# EAGLE schematic GSRv2 (EAGLE 7.4.0)
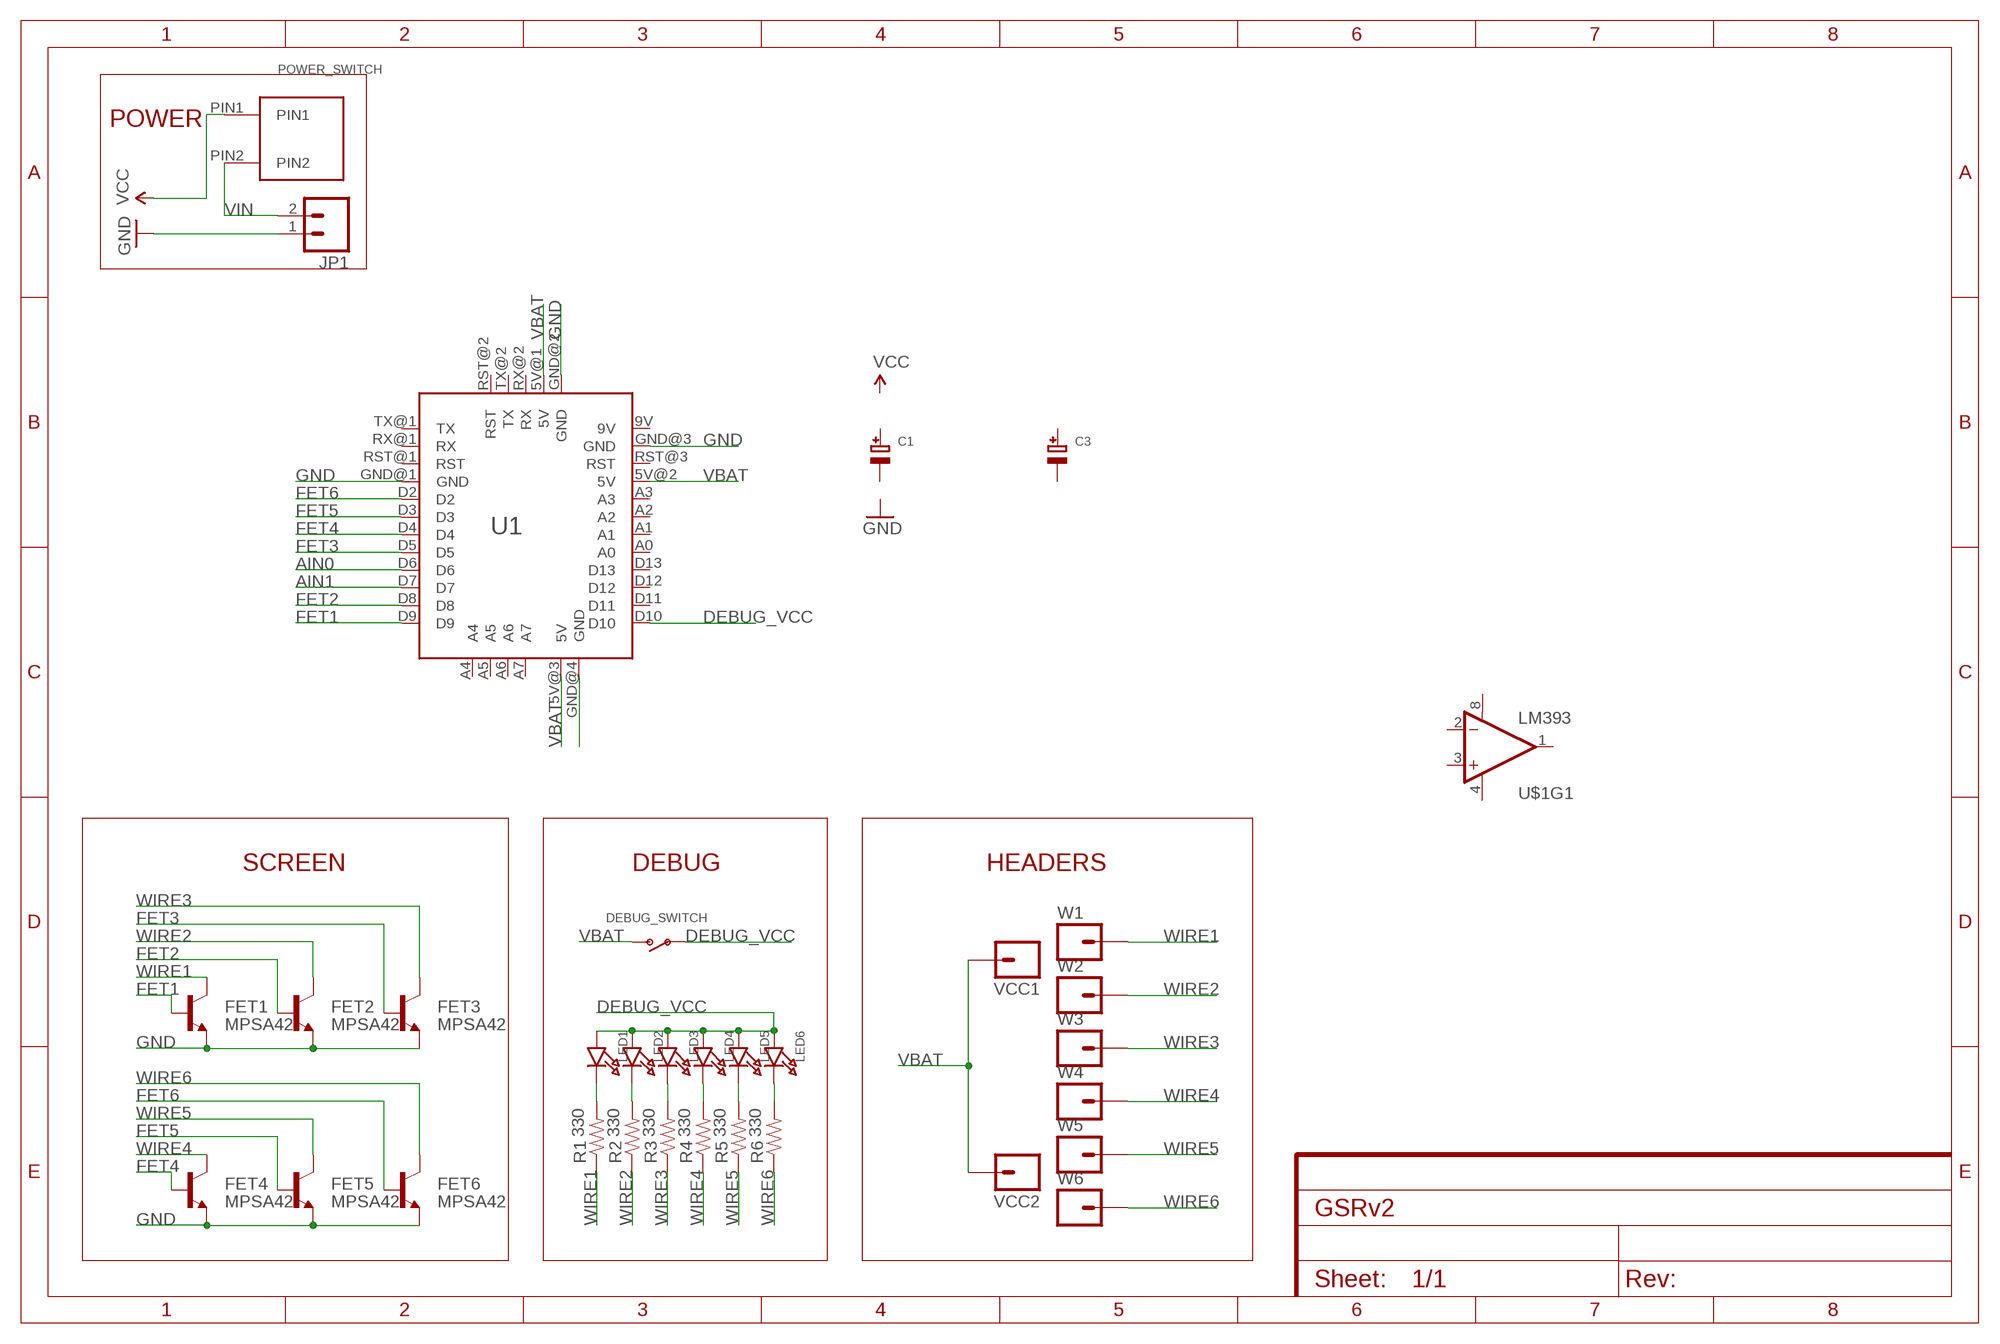
[diagram p0: schematic, sheet 1]

## Parts
C1  CAP_TANTALUMB/3528_WAVE  [EIA3528-21/B-W]
C3  CAP_TANTALUMB/3528_WAVE  [EIA3528-21/B-W]
DEBUG_SWITCH  SWITCH_SPST  [SPST_SMT_19192]
FET1  MPSA42  TRANSISTOR_NPNMPSA42  [SOT23-3]
FET2  MPSA42  TRANSISTOR_NPNMPSA42  [SOT23-3]
FET3  MPSA42  TRANSISTOR_NPNMPSA42  [SOT23-3]
FET4  MPSA42  TRANSISTOR_NPNMPSA42  [SOT23-3]
FET5  MPSA42  TRANSISTOR_NPNMPSA42  [SOT23-3]
FET6  MPSA42  TRANSISTOR_NPNMPSA42  [SOT23-3]
JP1  M02-JST-2MM-SMT  [JST-2-SMD]
LED1  LED0603_NOOUTLINE  [CHIPLED_0603_NOOUTLINE]
LED2  LED0603_NOOUTLINE  [CHIPLED_0603_NOOUTLINE]
LED3  LED0603_NOOUTLINE  [CHIPLED_0603_NOOUTLINE]
LED4  LED0603_NOOUTLINE  [CHIPLED_0603_NOOUTLINE]
LED5  LED0603_NOOUTLINE  [CHIPLED_0603_NOOUTLINE]
LED6  LED0603_NOOUTLINE  [CHIPLED_0603_NOOUTLINE]
POWER_SWITCH  PUSH_BUTTON  [PUSH_BUTTON]
R1  330  RESISTOR0603-RES  [0603-RES]
R2  330  RESISTOR0603-RES  [0603-RES]
R3  330  RESISTOR0603-RES  [0603-RES]
R4  330  RESISTOR0603-RES  [0603-RES]
R5  330  RESISTOR0603-RES  [0603-RES]
R6  330  RESISTOR0603-RES  [0603-RES]
U1  ARDUINO_MINI  [ARDUINO_MINI]
U$1  LM393  [SO08]
VCC1  M01NOSILK-KIT  [1X01NS-KIT]
VCC2  M01NOSILK-KIT  [1X01NS-KIT]
W1  M01NOSILK-KIT  [1X01NS-KIT]
W2  M01NOSILK-KIT  [1X01NS-KIT]
W3  M01NOSILK-KIT  [1X01NS-KIT]
W4  M01NOSILK-KIT  [1X01NS-KIT]
W5  M01NOSILK-KIT  [1X01NS-KIT]
W6  M01NOSILK-KIT  [1X01NS-KIT]

## Nets
AIN0: U1.D6
AIN1: U1.D7
DEBUG_VCC: DEBUG_SWITCH.B(P) LED1.A LED2.A LED3.A LED4.A LED5.A LED6.A U1.D10
FET1: FET1.1(B) U1.D9
FET2: FET2.1(B) U1.D8
FET3: FET3.1(B) U1.D5
FET4: FET4.1(B) U1.D4
FET5: FET5.1(B) U1.D3
FET6: FET6.1(B) U1.D2
GND: FET1.2(E) FET2.2(E) FET3.2(E) FET4.2(E) FET5.2(E) FET6.2(E) JP1.1 U1.GND@1(GND) U1.GND@2(GND) U1.GND@3(GND) U1.GND@4(GND)
N$1: LED1.C R1.2
N$2: LED2.C R2.2
N$3: LED3.C R3.2
N$4: LED4.C R4.2
N$5: LED5.C R5.2
N$6: LED6.C R6.2
VBAT: DEBUG_SWITCH.C(S) U1.5V@1(5V) U1.5V@2(5V) U1.5V@3(5V) VCC1.1 VCC2.1
VCC: POWER_SWITCH.PIN1
VIN: JP1.2 POWER_SWITCH.PIN2
WIRE1: FET1.3(C) R1.1 W1.1
WIRE2: FET2.3(C) R2.1 W2.1
WIRE3: FET3.3(C) R3.1 W3.1
WIRE4: FET4.3(C) R4.1 W4.1
WIRE5: FET5.3(C) R5.1 W5.1
WIRE6: FET6.3(C) R6.1 W6.1
Unconnected: C1.+ C1.- C3.+ C3.- U1.A0 U1.A1 U1.A2 U1.A3 U1.A4 U1.A5 U1.A6 U1.A7 U1.D11 U1.D12 U1.D13 U1.RST@1(RST) U1.RST@2(RST) U1.RST@3(RST) U1.RX@1(RX) U1.RX@2(RX) U1.TX@1(TX) U1.TX@2(TX) U$1.1(OUT) U$1.2(-IN) U$1.3(+IN) U$1.5(+IN) U$1.6(-IN) U$1.7(OUT)

## Notes on the sheet
- POWER
- SCREEN | DEBUG | HEADERS

## Power pins joined to a net without a drawn wire
9V: U1.9V
V+: U$1.8(V+)
V-: U$1.4(V-)

## Library data of the parts
C1 C3 = microbuilder:CAP_TANTALUM: Tantalum Capacitors Wave footprints have larger pads and are meant to be used for hand soldering. Reflow footprints are optimised for solder paste and a reflow oven. EIA3216-18/A-[R/W] - Size A / 3216-18 / 1206 footprint 4.7µF 25V 10% Tantalum Capacitor 10µF 16V 10% Tantalum Capacitor [Digikey: 495-2236-2-ND] EIA3528-21/B-[R/W] - Size B / 3528-21 47µF 10V 10% Tantalum Capactior [Digikey: 495-2216-1-ND] EIA6032-28/C-[R/W] - Size C / 6032-28 10µF 35V 20% Tantalum Capacitor [Digikey: 495-2285-1-ND] 100µF 16V 10% Tantalum Capactior [Digikey: 399-5214-1-ND]
DEBUG_SWITCH = microbuilder:SWITCH_SPST: Switch - SPST 4UCon 19192 (6.7x2.6mm SMT)
FET1-FET6 = SparkFun-DiscreteSemi:TRANSISTOR_NPN: Generic NPN BJT MMBT2222A - TRANS-08049 (SOT-23, 1A 40V) MPSA42 - TRANS-09116 (SOT-23, 500mA 300V) MMBT5088LT1G - TRANS-11160 (SOT-23, 50 mA 30V) BC547 - COM-08928 <http://www.sparkfun.com/products/8928> (TO-92 45V 100mA) (1.Collector 2.Base 3.Emitter) 2N3904 - COM-00521 <http://www.sparkfun.com/products/521> (TO-92 40V 200mA) (1.Emitter 2.Base 3.Collector) P2N2222A - COM-12852 <http://www.sparkfun.com/products/12852> (TO-92 40V 600mA) (1.Collector 2.Base 3.Emitter); PROD_ID: TRANS-09116
JP1 = SparkFun-Connectors:M02: Standard 2-pin 0.1" header. Use with - straight break away headers ( PRT-00116) - right angle break away headers (PRT-00553) - swiss pins (PRT-00743) - machine pins (PRT-00117) - female headers (PRT-00115) Molex polarized connector foot print use with: PRT-08233 with associated crimp pins and housings. 2.54_SCREWTERM for use with PRT-10571. 3.5mm Screw Terminal footprints for PRT-08084 5mm Screw Terminal footprints for use with PRT-08432; PROD_ID: CONN-11443
LED1-LED6 = microbuilder:LED: LED 0603 - 0603 Surface Mount Package 2mA: Green LED - Low Power (3.9mcd, 2ma, 1.7Vf) - Digikey: 475-2709-2-ND Orange LED - Low Power (9.8mcd, 2ma, 1.8Vf) - Digikey: 475-1194-2-ND Red LED - Low Power (5mcd, 2ma, 1.8Vf) - Digikey: 475-1195-2-ND Yellow LED - Low Power (7mcd, 2ma, 1.8Vf) - Digikey: 475-1196-2-ND 5mA: Blue LED - Low Power (17mcd, 5ma, 2.9Vf) - Digikey: LNJ937W8CRACT-ND 0805 - 0805 Surface Mount Package 2mA: Red LED (8.8mcd, 2mA, 1.8Vf, Clear) - Low Power [Digikey: 475-2510-1-ND] Green LED (5mcd, 2mA, 1.8Vf, Clear) - Low Power [Digikey: 475-2730-1-ND] Yellow LED (11.3mcd, 2mA, 1.8Vf, Clear) - Low Power [Digikey: 475-2555-1-ND] 20mA: Red LED (104mcd, 20mA, Diffused) - LS R976 [Digikey: 475-1278-6-ND] Red LED (12mcd, 20mA, 2.0Vf, Clear) - APT2012EC [Digikey: 754-1128-1-ND] Green LED (15mcd, 20mA, 2.2Vf, Clear) - APT2012GC [Digikey: 754-1131-1-ND] Orange LED (160mcd, 20mA, 2.1Vf, Clear) - APT2012SECK [Digikey: 754-1130-1-ND] 1206 - 1206 Surface Mount Package Green LED (26mcd, 20mA, Diffused) - LG N971 [Digikey: 475-1407-6-ND] Red LED (15mcd, 20mA, Diffused) - LH N974 [Digikey: 475-1416-6-ND]
POWER_SWITCH = myParts:PUSH_BUTTON
R1-R6 = SparkFun-Passives:RESISTOR: Resistor Basic schematic elements and footprints for 0603, 1206, and PTH resistors.
U1 = myParts:ARDUINO_MINI: Arduino Mini V5 Footprint
U$1 = SparkFun-AnalogIC:LM393: Low-voltage comparator
VCC1 VCC2 W1-W6 = SparkFun-Connectors:M01: Header 1 Standard 1-pin 0.1" header. Use with straight break away headers (SKU : PRT-00116), right angle break away headers (PRT-00553), swiss pins (PRT-00743), machine pins (PRT-00117), and female headers (PRT-00115).